# EAGLE design pcb v2 (EAGLE 9.6.2)
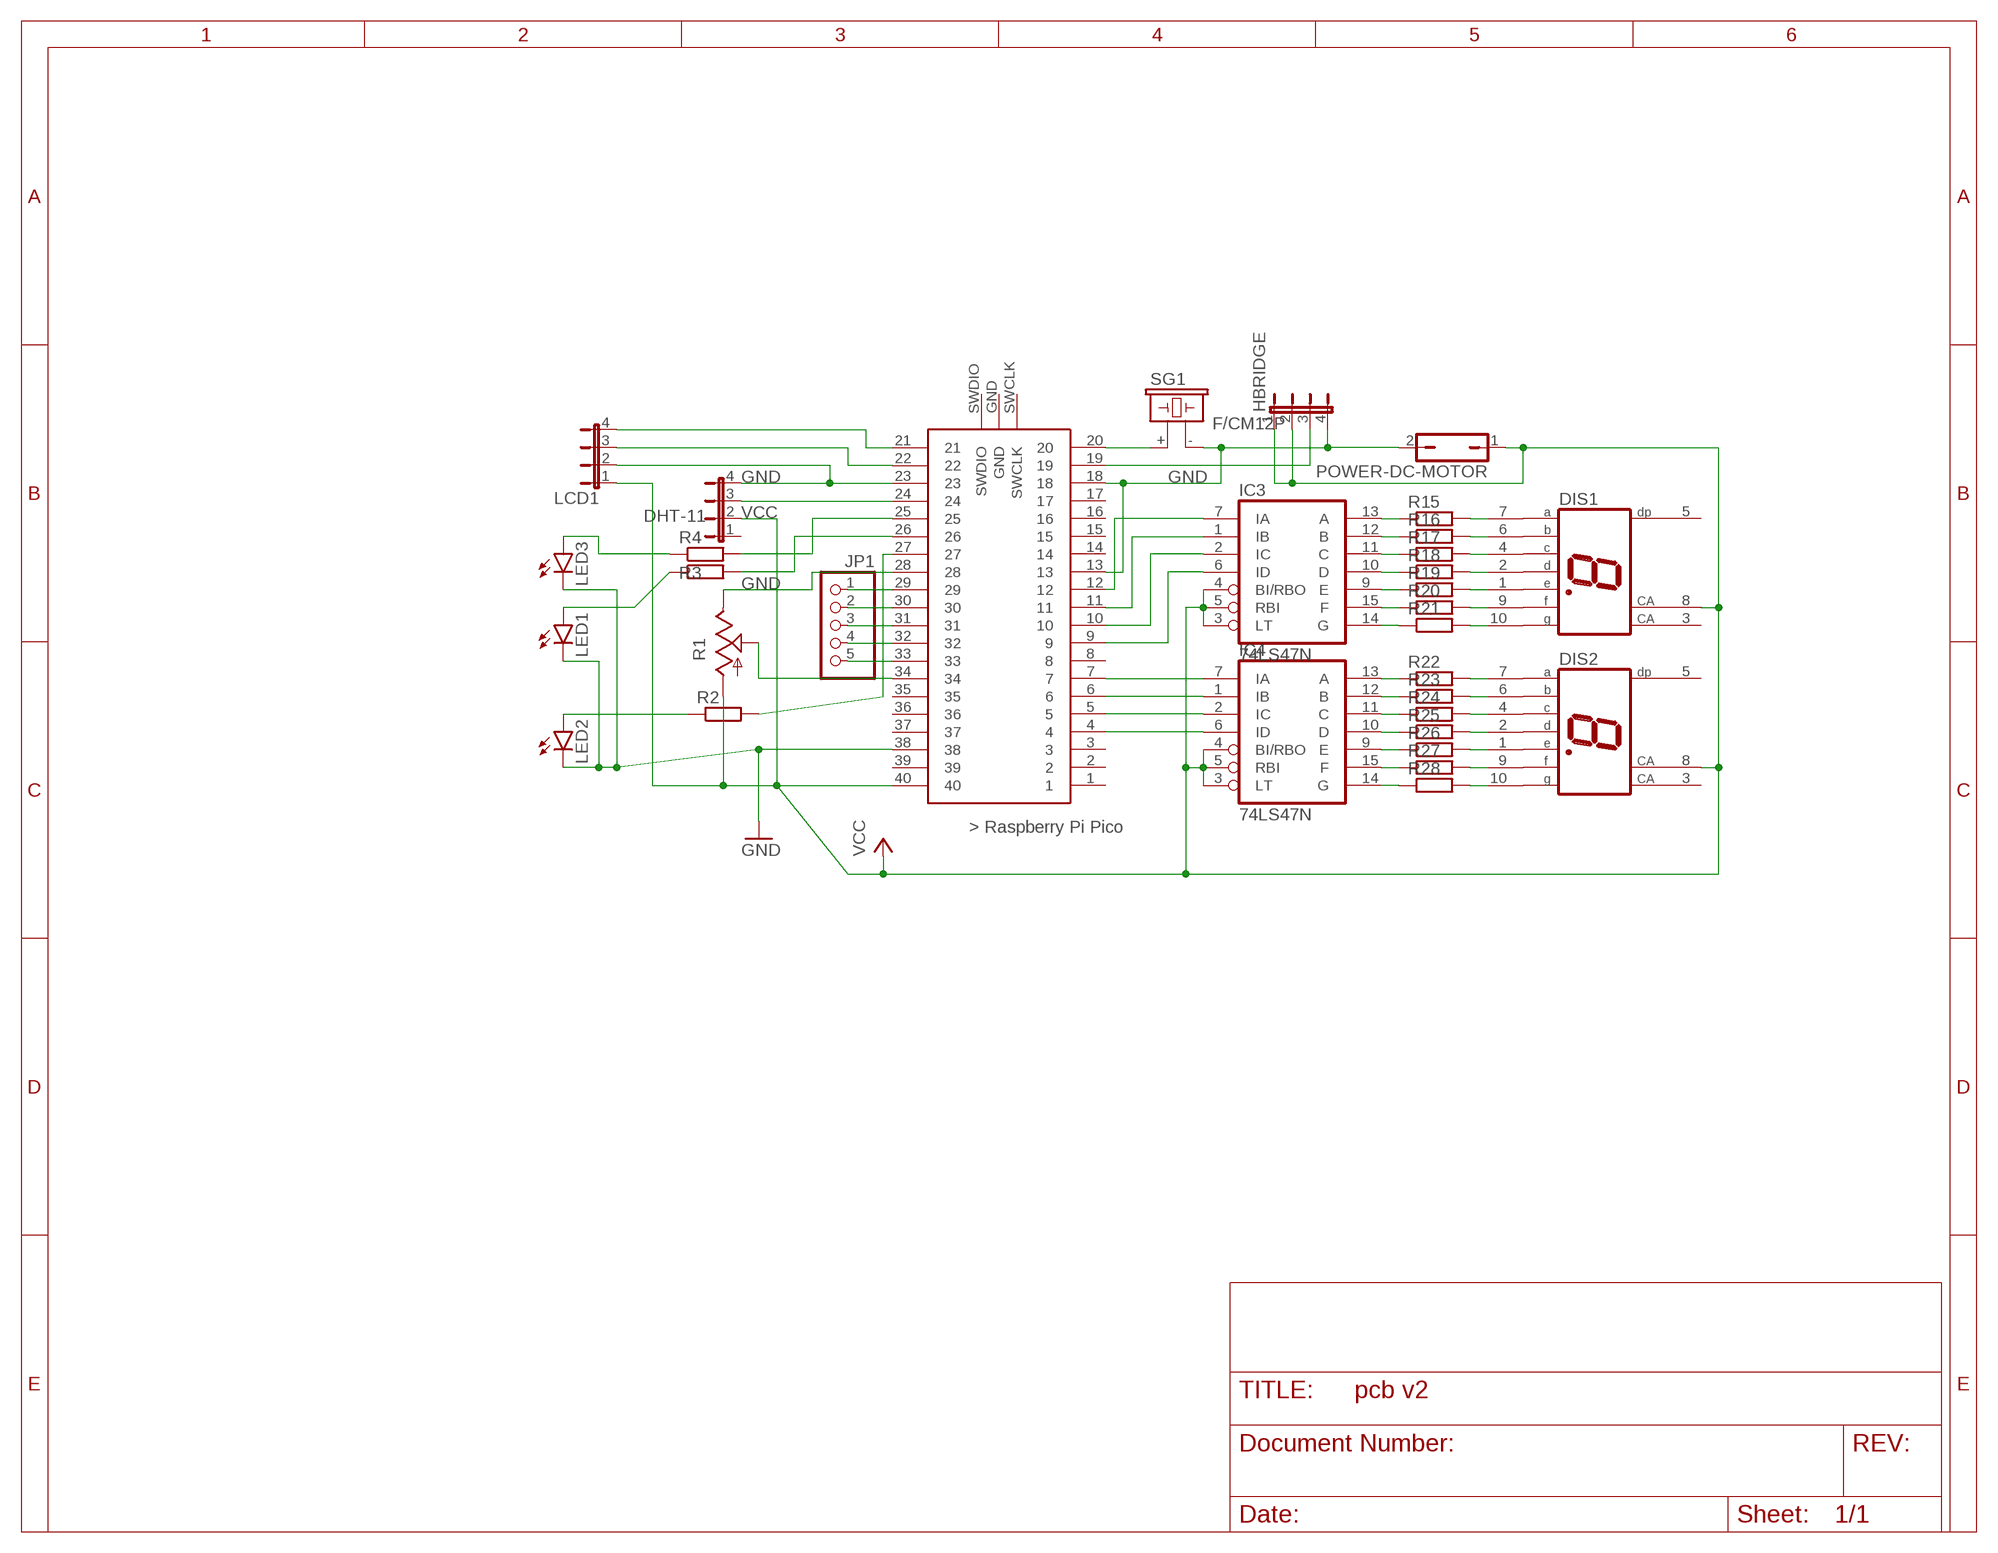
[diagram p0: schematic, sheet 1]

## Parts
DHT-11  JP4E  [JP4]
DIS1  HD-H101  [HDSP-M]
DIS2  HD-H101  [HDSP-M]
HBRIDGE  JP4E  [JP4]
IC3  74LS47N  [DIL16]
IC4  74LS47N  [DIL16]
JP1  PINHD-1X5  [1X05]
LCD1  JP4E  [JP4]
LED1  LED5MM  [LED5MM]
LED2  LED5MM  [LED5MM]
LED3  LED5MM  [LED5MM]
POWER-DC-MOTOR  JP1Q  [JP1]
R1  TRIM_US-CA6V  [CA6V]
R2  R-EU_0207/10  [0207/10]
R3  R-EU_0207/10  [0207/10]
R4  R-EU_0207/10  [0207/10]
R15  R-EU_0207/12  [0207/12]
R16  R-EU_0207/12  [0207/12]
R17  R-EU_0207/12  [0207/12]
R18  R-EU_0207/12  [0207/12]
R19  R-EU_0207/12  [0207/12]
R20  R-EU_0207/12  [0207/12]
R21  R-EU_0207/12  [0207/12]
R22  R-EU_0207/12  [0207/12]
R23  R-EU_0207/12  [0207/12]
R24  R-EU_0207/12  [0207/12]
R25  R-EU_0207/12  [0207/12]
R26  R-EU_0207/12  [0207/12]
R27  R-EU_0207/12  [0207/12]
R28  R-EU_0207/12  [0207/12]
SG1  F/CM12P  [F/CM12P]
U$1  RASPBERRY-PI-PICO_TH  [FT_RASPBERRY-PI-PICO_TH]

## Nets
GND: DHT-11.4 HBRIDGE.4 LCD1.2 LED1.K(C) LED2.K(C) LED3.K(C) POWER-DC-MOTOR.2 R1.E SG1.- U$1.13 U$1.18 U$1.23 U$1.28 U$1.38
N$1: IC4.7(IA) U$1.7
N$2: IC4.1(IB) U$1.6
N$3: IC4.2(IC) U$1.5
N$4: IC4.6(ID) U$1.4
N$5: R1.S U$1.34
N$6: IC3.14(G) R21.1
N$7: DIS2.7(A) R22.2
N$8: DIS2.6(B) R23.2
N$9: DIS2.4(C) R24.2
N$10: DIS2.2(D) R25.2
N$11: DIS2.1(E) R26.2
N$12: DIS1.10(G) R21.2
N$14: IC3.6(ID) U$1.9
N$15: IC3.2(IC) U$1.10
N$16: IC3.1(IB) U$1.11
N$17: IC3.7(IA) U$1.12
N$18: DIS2.9(F) R27.2
N$19: DIS2.10(G) R28.2
N$20: IC4.13(A) R22.1
N$21: IC4.12(B) R23.1
N$22: IC4.11(C) R24.1
N$23: DIS1.7(A) R15.2
N$24: DIS1.6(B) R16.2
N$25: DIS1.4(C) R17.2
N$26: DIS1.2(D) R18.2
N$27: DIS1.1(E) R19.2
N$28: JP1.1 U$1.29
N$29: JP1.2 U$1.30
N$30: IC4.10(D) R25.1
N$31: IC4.9(E) R26.1
N$32: IC4.15(F) R27.1
N$33: IC4.14(G) R28.1
N$34: SG1.+ U$1.20
N$35: JP1.3 U$1.31
N$36: DIS1.9(F) R20.2
N$37: IC3.13(A) R15.1
N$38: IC3.12(B) R16.1
N$39: IC3.11(C) R17.1
N$40: IC3.10(D) R18.1
N$41: IC3.9(E) R19.1
N$42: IC3.15(F) R20.1
N$43: HBRIDGE.3 U$1.19
N$44: JP1.4 U$1.32
N$45: DHT-11.3 U$1.24
N$46: LCD1.4 U$1.21
N$47: LCD1.3 U$1.22
N$48: JP1.5 U$1.33
N$51: R2.2 U$1.27
N$52: R4.2 U$1.25
N$53: R3.2 U$1.26
N$54: LED2.A R2.1
N$55: LED1.A R3.1
N$56: LED3.A R4.1
VCC [New Class]: DHT-11.2 DIS1.8(CA) DIS2.8(CA) HBRIDGE.1 HBRIDGE.2 IC3.3(LT) IC3.4(BI/RBO) IC3.5(RBI) IC4.3(LT) IC4.4(BI/RBO) IC4.5(RBI) LCD1.1 POWER-DC-MOTOR.1 R1.A U$1.40
Unconnected: DHT-11.1 DIS1.3(CA) DIS1.5(DP) DIS2.3(CA) DIS2.5(DP) U$1.1 U$1.2 U$1.3 U$1.8 U$1.14 U$1.15 U$1.16 U$1.17 U$1.35 U$1.36 U$1.37 U$1.39 U$1.GND U$1.SWCLK U$1.SWDIO

## Power pins joined to a net without a drawn wire
GND: IC3.8(GND) IC4.8(GND)
VCC: IC3.16(VCC) IC4.16(VCC)

## Library data of the parts
DHT-11 HBRIDGE LCD1 = jumper:JP4E: JUMPER
DIS1 DIS2 = display-hp:HD-H101: LED DISPLAY 1-character 7 segment, decimal point right; OC_FARNELL: unknown; OC_NEWARK: unknown
IC3 IC4 = 74xx-eu:74*47: BCD to seven segment DECODER/DRIVER Source: http://www.ee.washington.edu/stores/DataSheets/74ls/74ls47.pdf
JP1 = pinhead:PINHD-1X5: PIN HEADER
LED1-LED3 = led:LED: LED OSRAM: - CHIPLED LG R971, LG N971, LY N971, LG Q971, LY Q971, LO R971, LY R971 LH N974, LH R974 LS Q976, LO Q976, LY Q976 LO Q996 - Hyper CHIPLED LW Q18S LB Q993, LB Q99A, LB R99A - SideLED LS A670, LO A670, LY A670, LG A670, LP A670 LB A673, LV A673, LT A673, LW A673 LH A674 LY A675 LS A676, LA A676, LO A676, LY A676, LW A676 LS A679, LY A679, LG A679 - Hyper Micro SIDELED® LS Y876, LA Y876, LO Y876, LY Y876 LT Y87S - SmartLED LW L88C, LW L88S LB L89C, LB L89S, LG L890 LS L89K, LO L89K, LY L89K LS L896, LA L896, LO L896, LY L896 - TOPLED LS T670, LO T670, LY T670, LG T670, LP T670 LSG T670, LSP T670, LSY T670, LOP T670, LYG T670 LG T671, LOG T671, LSG T671 LB T673, LV T673, LT T673, LW T673 LH T674 LS T676, LA T676, LO T676, LY T676, LB T676, LH T676, LSB T676, LW T676 LB T67C, LV T67C, LT T67C, LS T67K, LO T67K, LY T67K, LW E67C LS E67B, LA E67B, LO E67B, LY E67B, LB E67C, LV E67C, LT E67C LW T67C LS T679, LY T679, LG T679 LS T770, LO T770, LY T770, LG T770, LP T770 LB T773, LV T773, LT T773, LW T773 LH T774 LS E675, LA E675, LY E675, LS T675 LS T776, LA T776, LO T776, LY T776, LB T776 LHGB T686 LT T68C, LB T68C - Hyper Mini TOPLED® LB M676 - Mini TOPLED Santana® LG M470 LS M47K, LO M47K, LY M47K Source: http://www.osram.convergy.de LUXEON: - LUMILED® LXK2-PW12-R00, LXK2-PW12-S00, LXK2-PW14-U00, LXK2-PW14-V00 LXK2-PM12-R00, LXK2-PM12-S00, LXK2-PM14-U00 LXK2-PE12-Q00, LXK2-PE12-R00, LXK2-PE12-S00, LXK2-PE14-T00, LXK2-PE14-U00 LXK2-PB12-K00, LXK2-PB12-L00, LXK2-PB12-M00, LXK2-PB14-N00, LXK2-PB14-P00, LXK2-PB14-Q00 LXK2-PR12-L00, LXK2-PR12-M00, LXK2-PR14-Q00, LXK2-PR14-R00 LXK2-PD12-Q00, LXK2-PD12-R00, LXK2-PD12-S00 LXK2-PH12-R00, LXK2-PH12-S00 LXK2-PL12-P00, LXK2-PL12-Q00, LXK2-PL12-R00 Source: www.luxeon.com KINGBRIGHT: KA-3528ASYC Source: www.kingbright.com
POWER-DC-MOTOR = jumper:JP1Q: JUMPER
R1 = pot:TRIM_US-: POTENTIOMETER
R2-R4 R15-R28 = rcl:R-EU_: RESISTOR, European symbol; SPICEPREFIX: R
SG1 = buzzer:F/CM12P: BUZZER Source: Buerklin; OC_FARNELL: unknown; OC_NEWARK: unknown
U$1 = pipico:RASPBERRY-PI-PICO_TH: Raspberry Pi Pico microcontroller board for through-hole mounting.

## Board
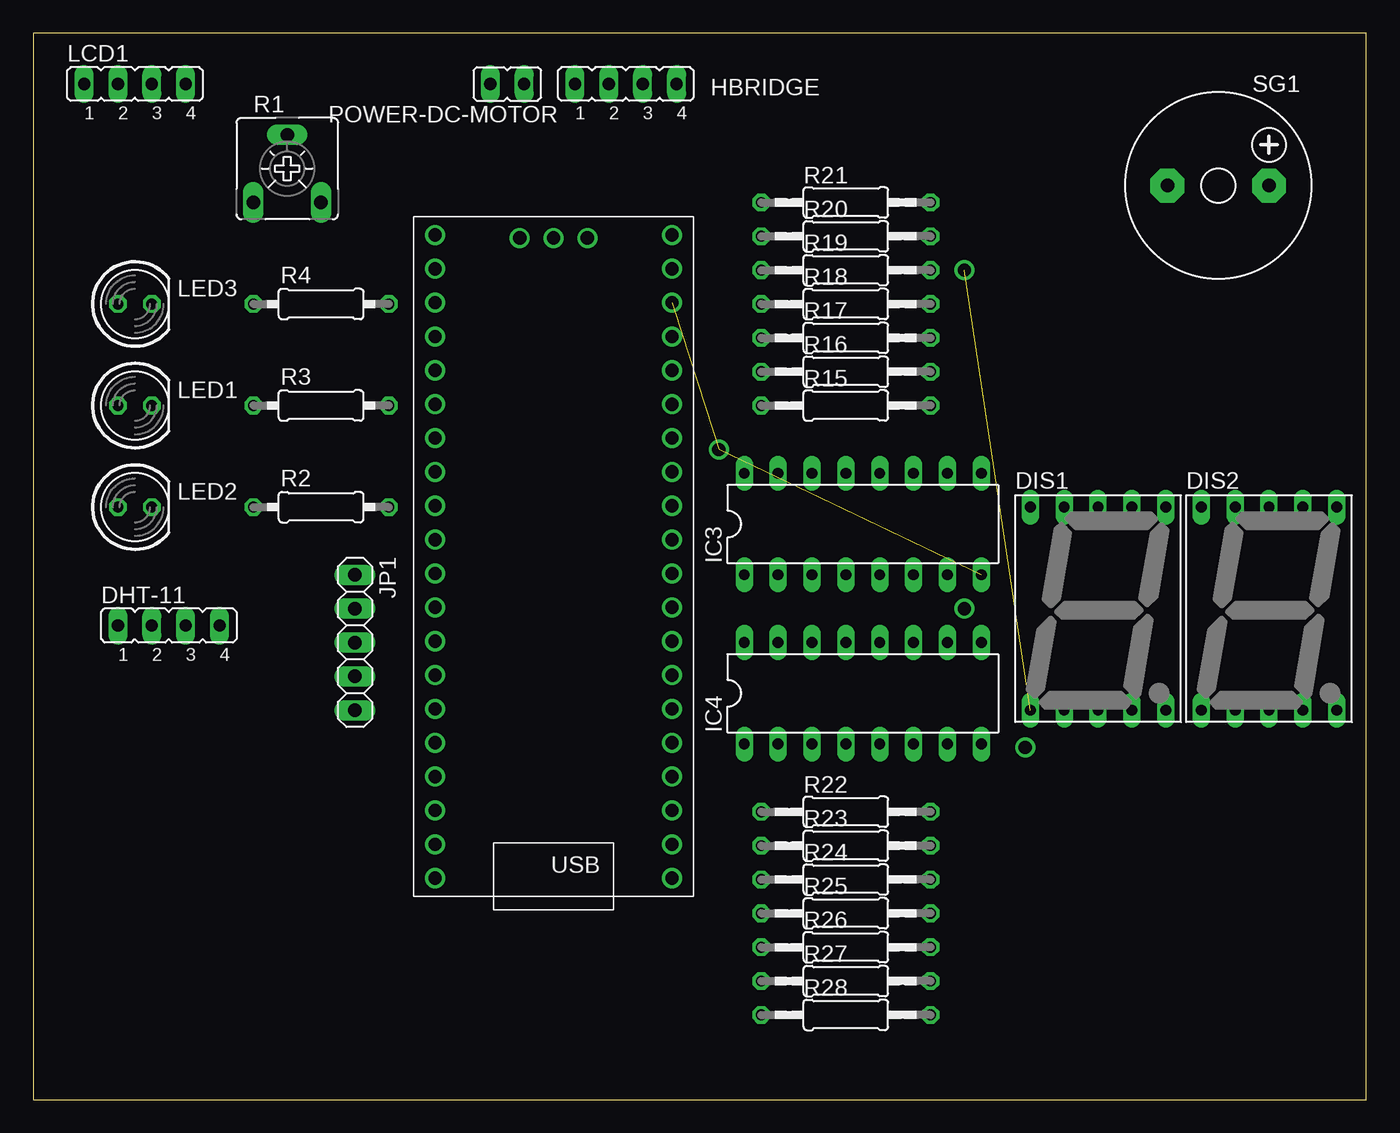
[diagram p1: board, top side]
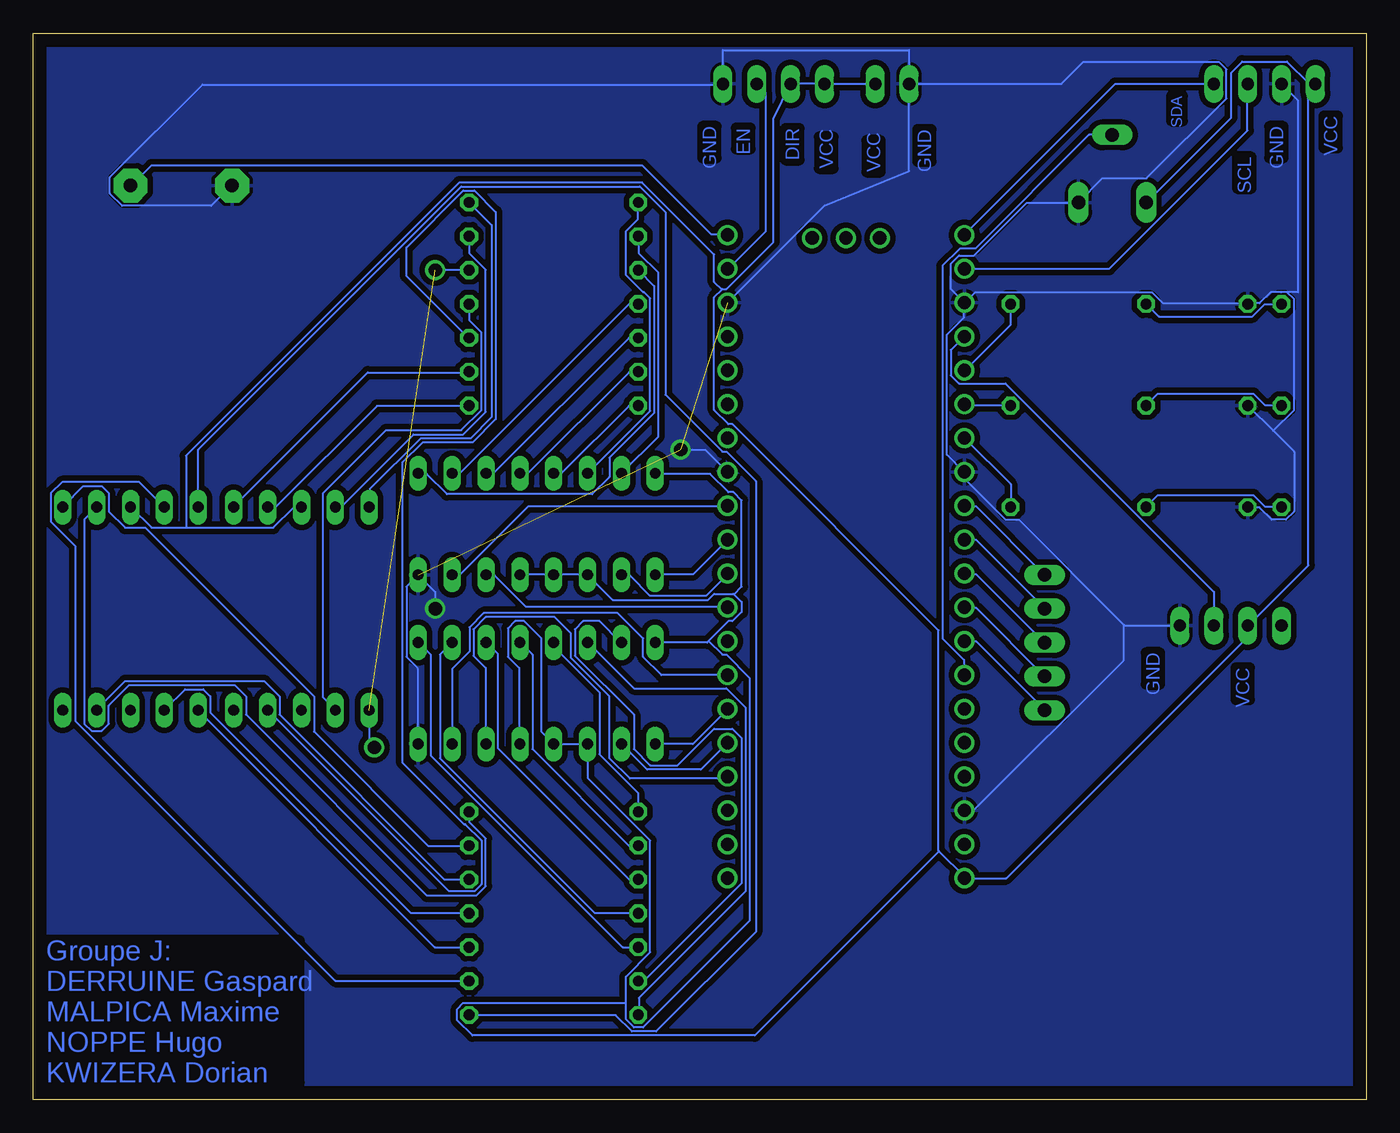
[diagram p2: board, bottom side, seen from below]

Size 100 x 80 mm. Coordinates in mm from the lower left corner, seen from the top.
Outline: 0,0 100,0 100,80 0,80 0,0
Copper layers (1*16): Top 0.035mm / dielectric 1.5mm / Bottom 0.035mm
Design rules "default": minimum track width 6mil, minimum drill 0.35mm, track to track 6mil, track to pad 6mil, pad to pad 6mil, via to via 6mil, smd to smd 6mil, copper to edge 40mil, drill to drill 6mil, minimum pad ring 10mil, minimum via ring 8mil, stop-mask expansion 4mil, vias tented up to drill 0mil, thermal gap 10mil

### Footprints (pad centres in the part's own frame; a part is rotated, then mirrored left to right if it is on the bottom)
JP4 = drill 0.914 long: 1 -3.81,0; 2 -1.27,0; 3 1.27,0; 4 3.81,0
HDSP-M = drill 0.813 long: 1 -5.08,-7.62; 2 -2.54,-7.62; 3 0,-7.62; 4 2.54,-7.62; 5 5.08,-7.62; 6 5.08,7.62; 7 2.54,7.62; 8 0,7.62; 9 -2.54,7.62; 10 -5.08,7.62
DIL16 = drill 0.813 long: 1 -8.89,-3.81; 2 -6.35,-3.81; 3 -3.81,-3.81; 4 -1.27,-3.81; 5 1.27,-3.81; 6 3.81,-3.81; 7 6.35,-3.81; 8 8.89,-3.81; 9 8.89,3.81; 10 6.35,3.81; 11 3.81,3.81; 12 1.27,3.81; 13 -1.27,3.81; 14 -3.81,3.81; 15 -6.35,3.81; 16 -8.89,3.81
1X05 = drill 1.016 long: 1 -5.08,0; 2 -2.54,0; 3 0,0; 4 2.54,0; 5 5.08,0
LED5MM = drill 0.813 octagon: A -1.27,0; K 1.27,0
JP1 = drill 0.914 long: 1 0,-1.27; 2 0,1.27
CA6V = drill 1.016 long: A -2.54,-2.54; E 2.54,-2.54; S 0,2.54
0207/10 = drill 0.813 octagon: 1 -5.08,0; 2 5.08,0
0207/12 = drill 0.813 octagon: 1 -6.35,0; 2 6.35,0
F/CM12P = drill 1.016 pad 2.54 octagon: + 3.81,0; - -3.81,0
FT_RASPBERRY-PI-PICO_TH = drill 1: 1 -8.55,24.03; 2 -8.55,21.49; 3 -8.55,18.95; 4 -8.55,16.41; 5 -8.55,13.87; 6 -8.55,11.33; 7 -8.55,8.79; 8 -8.55,6.25; 9 -8.55,3.71; 10 -8.55,1.17; 11 -8.55,-1.37; 12 -8.55,-3.91; 13 -8.55,-6.45; 14 -8.55,-8.99; 15 -8.55,-11.53; 16 -8.55,-14.07; 17 -8.55,-16.61; 18 -8.55,-19.15; 19 -8.55,-21.69; 20 -8.55,-24.23; 21 9.23,-24.23; 22 9.23,-21.69; 23 9.23,-19.15; 24 9.23,-16.61; 25 9.23,-14.07; 26 9.23,-11.53; 27 9.23,-8.99; 28 9.23,-6.45; 29 9.23,-3.91; 30 9.23,-1.37; 31 9.23,1.17; 32 9.23,3.71; 33 9.23,6.25; 34 9.23,8.79; 35 9.23,11.33; 36 9.23,13.87; 37 9.23,16.41; 38 9.23,18.95; 39 9.23,21.49; 40 9.23,24.03; GND 0.34,-24; SWCLK -2.2,-24; SWDIO 2.88,-24

### Placement (x,y rotation side)
DHT-11  10.16,35.56 0 top
DIS1  79.88,36.83 0 top
DIS2  92.71,36.83 0 top
HBRIDGE  44.45,76.2 0 top
IC3  62.23,43.18 0 top
IC4  62.23,30.48 0 top
JP1  24.13,34.29 270 top
LCD1  7.62,76.2 0 top
LED1  7.62,52.07 0 top
LED2  7.62,44.45 0 top
LED3  7.62,59.69 0 top
POWER-DC-MOTOR  35.56,76.2 90 top
R1  19.05,69.85 0 top
R2  21.59,44.45 0 top
R3  21.59,52.07 0 top
R4  21.59,59.69 0 top
R15  60.96,52.07 0 top
R16  60.96,54.61 0 top
R17  60.96,57.15 0 top
R18  60.96,59.69 0 top
R19  60.96,62.23 0 top
R20  60.96,64.77 0 top
R21  60.96,67.31 0 top
R22  60.96,21.59 0 top
R23  60.96,19.05 0 top
R24  60.96,16.51 0 top
R25  60.96,13.97 0 top
R26  60.96,11.43 0 top
R27  60.96,8.89 0 top
R28  60.96,6.35 0 top
SG1  88.9,68.58 0 top
U$1  39.37,40.64 180 top

### Tracks (layer width: path | path; a pad name or v marks a point on that pad's centre or on a via)
GND  (via drill 1)  (2 unrouted)
  Bottom 0.152: 6.97,50.18 8.84,52.05 LED1.K | 6.97,50.18 5.41,48.62 5.41,44.12 6.02,43.51 7.09,43.51 8,44.42 8.84,44.42 LED2.K | 5.94,60.58 6.4,60.58 7.16,60.58 8,59.74 8.84,59.74 LED3.K 8.91,59.74 15.24,59.74 16.08,60.58 29.34,60.58 30.1,59.82 U$1.23 | 5.94,60.58 5.13,60.58 5.13,74.98 LCD1.2 | 5.94,60.58 5.41,60.05 5.41,51.74 6.97,50.18 | POWER-DC-MOTOR.2 34.29,69.66 40.63,67.08 U$1.18 | 18.17,35.62 26.06,43.51 27.05,43.51 30.1,46.56 30.1,47.02 U$1.28 30.18,47.09 31.47,48.39 31.47,57.38 30.18,58.67 30.18,59.74 U$1.23 | 18.17,35.62 18.14,35.59 14.02,35.59 DHT-11.4 | U$1.38 30.1,21.72 29.41,21.72 18.21,32.92 18.21,35.59 18.17,35.62 | U$1.23 30.18,59.82 31.17,60.81 31.17,62.71 30.56,63.32 29.41,63.32 25.45,67.28 21.64,67.28 R1.E 19.79,69.11 16.48,69.11 10.49,75.1 10.49,77.3 11.04,77.85 21.21,77.85 22.86,76.2 POWER-DC-MOTOR.2 | IC4.8 71.17,26.67 71.17,32.38 72.01,33.22 72.01,38.48 IC3.8 69.85,38.1 v69.85,36.83 | SG1.- 85.11,68.58 86.64,67.06 93.34,67.06 94.26,67.97 94.26,69.19 87.3,76.15 48.31,76.15 HBRIDGE.4 48.26,78.74 34.29,78.74 POWER-DC-MOTOR.2 | U$1.13 49.6,48.77 v51.44,48.77
  pour Bottom (isolate 0.406): 0,80.01 100.33,80.01 100.33,0 0,0
N$1
  Bottom 0.152: IC4.7 68.58,32.31 67.28,33.6 67.28,35.43 66.22,36.5 56.16,36.5 54.25,34.59 54.25,33.22 52.88,31.85 U$1.7
N$2
  Bottom 0.152: IC4.1 50.52,26.67 47.93,29.26 U$1.6
N$3
  Bottom 0.152: IC4.2 55.85,26.67 53.95,24.77 49.91,24.77 47.93,26.75 U$1.5
N$4
  Bottom 0.152: IC4.6 66.06,26.67 66.06,32.38 66.98,33.3 66.98,35.28 66.06,36.2 60.88,36.2 59.66,34.98 59.66,33.15 56.77,30.25 56.77,25.6 55.24,24.08 48.01,24.08 47.93,24.16 U$1.4
N$5
  Bottom 0.152: R1.S 20.8,72.39 29.34,63.86 30.48,63.86 31.77,62.56 31.77,34.59 30.18,32.99 30.18,31.85 U$1.34
N$6
  Bottom 0.152: R21.1 54.63,67.28 54.63,66.06 55.55,65.15 55.55,61.87 54.25,60.58 54.18,60.58 53.72,60.12 53.72,51.66 58.37,47.02 IC3.14
N$7
  Bottom 0.152: R22.2 67.28,21.57 67.28,20.8 66.06,19.58 66.06,16 66.75,15.32 70.48,15.32 84.05,28.88 84.05,30.25 84.89,31.09 92.81,31.09 94.34,29.57 94.34,28.19 94.87,27.66 95.63,27.66 96.16,28.19 96.16,43.51 95.25,44.42 DIS2.7
N$8
  Bottom 0.152: R23.2 70.38,19.05 78.94,27.61 78.94,30.25 91.59,42.9 93.12,42.9 94.34,44.12 94.34,45.49 94.87,46.02 96.24,46.02 97.77,44.5 DIS2.6
N$9
  Bottom 0.152: R24.2 67.36,16.54 69.19,16.54 81.53,28.88 81.53,30.25 82.68,31.39 93.12,31.39 95.25,29.26 DIS2.4
N$10
  Bottom 0.152: R25.2 67.36,14.02 71.7,14.02 86.72,29.03 86.72,30.25 87.25,30.79 88.62,30.79 90.14,29.26 DIS2.2
N$11
  Bottom 0.152: R26.2 69.88,11.43 87.63,29.18 DIS2.1
N$12
  Bottom 0.152: R21.2 65.61,65.61 65.61,51.21 67.21,49.61 70.94,49.61 74.75,45.8 74.75,44.5 DIS1.10
N$14
  Bottom 0.152: IC3.6 65.99,39.32 65.38,39.32 63.02,36.96 47.93,36.96 U$1.9
N$15
  Bottom 0.152: IC3.2 55.85,39.32 55.24,39.32 53.72,37.8 49.53,37.8 47.93,39.4 U$1.10
N$16
  Bottom 0.152: IC3.1 53.34,39.4 50.52,39.4 47.93,41.99 U$1.11
N$17
  Bottom 0.152: IC3.7 68.58,39.4 67.97,39.4 62.87,44.5 47.93,44.5 U$1.12
N$18
  Bottom 0.152: DIS2.9 92.05,46.33 97.84,46.33 98.68,45.49 98.68,43.36 96.85,41.53 96.85,28.42 77.34,8.91 67.36,8.91 R27.2
N$19
  Bottom 0.152: DIS2.10 87.63,48.77 67.89,68.5 54.48,68.5 52.58,66.6 52.58,52.88 48.31,48.62 48.01,48.62 45.8,46.41 45.8,12.57 53.26,5.11 55.09,5.11 56.31,6.33 67.28,6.33 R28.2
N$20
  Bottom 0.152: IC4.13 60.96,33.98 57.53,30.56 57.53,25.91 54.63,23.01 54.63,21.64 R22.1
N$21
  Bottom 0.152: R23.1 55.32,19.05 62.56,26.29 62.56,33.38 63.48,34.29 IC4.12
N$22
  Bottom 0.152: R24.1 54.63,16.54 55.32,16.54 65.15,26.36 65.15,33.45 65.99,34.29 IC4.11
N$23
  Bottom 0.152: DIS1.7 82.37,44.5 81.76,44.5 74.22,52.05 67.36,52.05 R15.2
N$24
  Bottom 0.152: R16.2 67.36,54.56 74.91,54.56 84.96,44.5 DIS1.6
N$25
  Bottom 0.152: DIS1.4 82.37,29.18 68.81,15.62 66.9,15.62 66.37,16.15 66.37,19.43 67.59,20.65 67.67,20.65 72.31,25.3 72.31,47.78 70.79,49.3 67.06,49.3 65.3,51.05 65.3,66.6 66.9,68.2 67.74,68.2 72.01,63.93 72.01,61.8 67.36,57.15 R17.2
N$26
  Bottom 0.152: R18.2 67.28,59.66 67.28,58.45 66.37,57.53 66.37,51.74 67.89,50.22 73.53,50.22 78.26,45.49 78.26,30.18 77.34,29.26 DIS1.2
N$27  (via drill 1)  (1 unrouted)
  Bottom 0.152: DIS1.1 74.8,26.8 v74.42,26.42 | R19.2 v69.85,62.23
N$28
  Bottom 0.152: JP1.1 29.26,44.5 30.1,44.5 U$1.29
N$29
  Bottom 0.152: U$1.30 30.1,41.99 29.26,41.99 24.16,36.88 JP1.2
N$30
  Bottom 0.152: IC4.10 69.49,33.38 69.49,25.6 57.91,14.02 54.63,14.02 R25.1
N$31
  Bottom 0.152: R26.1 55.78,11.43 70.18,25.83 70.18,33.38 71.09,34.29 IC4.9
N$32
  Bottom 0.152: R27.1 54.56,8.91 54.18,8.91 46.86,16.23 46.86,27.13 47.55,27.81 48.92,27.81 51.66,25.07 53.72,25.07 54.94,26.29 54.94,28.88 59.36,33.3 59.36,35.28 58.75,35.89 57.53,35.89 55.93,34.29 IC4.15
N$33
  Bottom 0.152: R28.1 54.56,6.4 54.56,7.62 46.56,15.62 46.56,29.41 48.01,30.86 54.94,30.86 58.37,34.29 IC4.14
N$34
  Bottom 0.152: U$1.20 47.93,64.92 49.15,64.92 54.33,70.1 91.14,70.1 92.66,68.58 SG1.+
N$35
  Bottom 0.152: U$1.31 30.1,39.4 29.26,39.4 24.16,34.29 JP1.3
N$36
  Bottom 0.152: R20.2 67.28,64.77 67.28,63.48 66.06,62.26 66.06,51.59 67.74,49.91 71.48,49.91 76.89,44.5 77.34,44.5 DIS1.9
N$37
  Bottom 0.152: IC3.13 60.96,47.02 60.35,47.02 55.32,52.05 54.63,52.05 R15.1
N$38
  Bottom 0.152: IC3.12 63.48,47.02 62.87,47.02 55.32,54.56 54.63,54.56 R16.1
N$39
  Bottom 0.152: R17.1 55.32,57.15 65.46,47.02 65.99,47.02 IC3.11
N$40
  Bottom 0.152: IC3.10 68.58,47.02 67.97,47.02 55.32,59.66 54.63,59.66 R18.1
N$41
  Bottom 0.152: R19.1 53.42,61.04 53.42,51.51 56.77,48.16 56.77,46.71 58.06,45.41 68.96,45.41 70.48,46.94 71.09,46.94 IC3.9
N$42
  Bottom 0.152: IC3.15 53.11,49.76 53.11,62.03 54.56,63.48 54.56,64.77 R20.1
N$43
  Bottom 0.152: HBRIDGE.3 45.09,75.56 45.09,65.1 47.85,62.33 U$1.19
N$44
  Bottom 0.152: JP1.4 29.26,36.88 30.1,36.88 U$1.32
N$45
  Bottom 0.152: DHT-11.3 11.43,38.1 27.05,53.72 30.56,53.72 31.17,54.33 31.17,56.24 30.18,57.23 U$1.24
N$46
  Bottom 0.152: LCD1.4 13.97,76.2 18.82,76.2 30.1,64.92 U$1.21
N$47
  Bottom 0.152: LCD1.3 8.91,76.2 8.91,72.69 19.28,62.33 30.1,62.33 U$1.22
N$48
  Bottom 0.152: U$1.33 30.1,34.37 29.26,34.37 24.16,29.26 JP1.5
N$51
  Bottom 0.152: R2.2 26.67,46.18 30.1,49.61 U$1.27
N$52
  Bottom 0.152: R4.2 26.67,58.14 30.1,54.71 U$1.25
N$53
  Bottom 0.152: R3.2 26.67,52.12 30.1,52.12 U$1.26
N$54
  Bottom 0.152: R2.1 15.62,45.34 8.46,45.34 7.62,44.5 6.4,44.5 LED2.A
N$55
  Bottom 0.152: R3.1 15.62,52.96 8.46,52.96 7.62,52.12 6.4,52.12 LED1.A
N$56
  Bottom 0.152: LED3.A 6.4,59.66 7.62,59.66 8.53,58.75 15.54,58.75 16.46,59.66 R4.1
VCC
  Bottom 0.152: IC4.5 63.55,26.67 63.55,32.38 64.39,33.22 64.39,35.36 63.86,35.89 63.17,35.89 61.87,34.59 61.87,27.58 IC4.4 IC4.3 58.37,26.67 58.37,24.08 53.72,19.43 53.72,11.05 55.55,9.22 55.55,7.24 | IC4.16 49.45,34.29 49.34,34.4 | 49.34,34.4 47.85,35.89 47.55,35.89 46.86,36.58 46.86,37.34 47.43,37.91 | 47.43,37.91 47.47,37.95 48.92,37.95 49.38,37.49 56.54,37.49 IC3.3 58.45,39.4 60.96,39.4 | 60.96,39.4 63.48,39.4 IC3.5 | 60.96,39.4 IC3.4 | 47.43,37.91 46.86,38.48 46.86,44.96 47.47,45.57 47.85,45.57 49.23,46.94 53.34,46.94 IC3.16 | 55.55,7.24 55.55,6.02 54.94,5.41 54.25,5.41 46.25,13.41 46.25,31.62 48.01,33.38 48.31,33.38 49.34,34.4 | R1.A 10.13,73.69 10.13,77.04 9.3,77.88 5.94,77.88 4.27,76.2 LCD1.1 4.34,76.2 4.34,40.08 8.84,35.59 DHT-11.2 8.89,34.72 27,16.61 30.1,16.61 U$1.40 30.1,16.69 32.04,18.63 | 88.54,42.9 91.14,42.9 92.66,44.42 DIS2.8 | 88.54,42.9 81.99,42.9 80.47,44.42 79.93,44.42 DIS1.8 | POWER-DC-MOTOR.1 36.88,76.22 40.62,76.22 HBRIDGE.1 40.69,76.22 43.13,76.22 HBRIDGE.2 44.48,73.61 44.48,64.34 48.01,60.81 48.31,60.81 48.35,60.77 | 48.35,60.77 48.92,60.2 48.92,51.74 47.85,50.67 47.55,50.67 32.08,35.2 32.08,18.67 32.04,18.63 | 88.54,42.9 88.54,48.31 68.05,68.81 54.33,68.81 48.92,63.4 48.92,61.34 48.35,60.77 | 55.55,7.24 67.74,7.24 68.2,6.78 68.2,5.94 67.06,4.8 45.87,4.8 32.04,18.63

### Text on the board
Bottom: SDA | VCC | GND | GND | EN | GND | SCL | VCC | VCC | DIR | GND | VCC | Groupe J: / DERRUINE Gaspard / MALPICA Maxime / NOPPE Hugo / KWIZERA Dorian